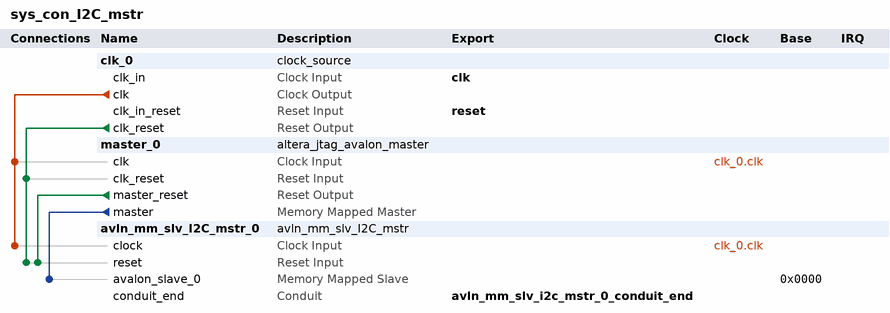
[diagram p0: system contents]
# Platform Designer (Qsys) system sys_con_I2C_mstr, Cyclone IV E EP4CE22F17C6
# Parameters at their usual value, and those the tool derives, are not listed.
package require -exact qsys 24.1
create_system sys_con_I2C_mstr
set_project_property DEVICE_FAMILY {Cyclone IV E}
set_project_property DEVICE EP4CE22F17C6

add_instance clk_0 clock_source 24.1
set_instance_parameter_value clk_0 clockFrequency 50000000

add_instance master_0 altera_jtag_avalon_master 24.1

add_instance avln_mm_slv_I2C_mstr_0 avln_mm_slv_I2C_mstr 1.0

# connections
add_connection clk_0.clk avln_mm_slv_I2C_mstr_0.clock clock
add_connection clk_0.clk master_0.clk clock
add_connection clk_0.clk_reset avln_mm_slv_I2C_mstr_0.reset reset
add_connection clk_0.clk_reset master_0.clk_reset reset
add_connection master_0.master_reset avln_mm_slv_I2C_mstr_0.reset reset
add_connection master_0.master avln_mm_slv_I2C_mstr_0.avalon_slave_0 avalon
set_connection_parameter_value master_0.master/avln_mm_slv_I2C_mstr_0.avalon_slave_0 baseAddress 0x0000

# exported interfaces
add_interface avln_mm_slv_i2c_mstr_0_conduit_end conduit end
set_interface_property avln_mm_slv_i2c_mstr_0_conduit_end EXPORT_OF avln_mm_slv_I2C_mstr_0.conduit_end
add_interface clk clock sink
set_interface_property clk EXPORT_OF clk_0.clk_in
add_interface reset reset sink
set_interface_property reset EXPORT_OF clk_0.clk_in_reset

set_interconnect_requirement {$system} qsys_mm.clockCrossingAdapter HANDSHAKE
set_interconnect_requirement {$system} qsys_mm.enableEccProtection FALSE
set_interconnect_requirement {$system} qsys_mm.insertDefaultSlave FALSE
set_interconnect_requirement {$system} qsys_mm.maxAdditionalLatency 1

save_system sys_con_I2C_mstr.qsys
